# Altium schematic sheet supply_filter.SchDoc
size A4; SheetNumber: 4; SheetTotal: 5
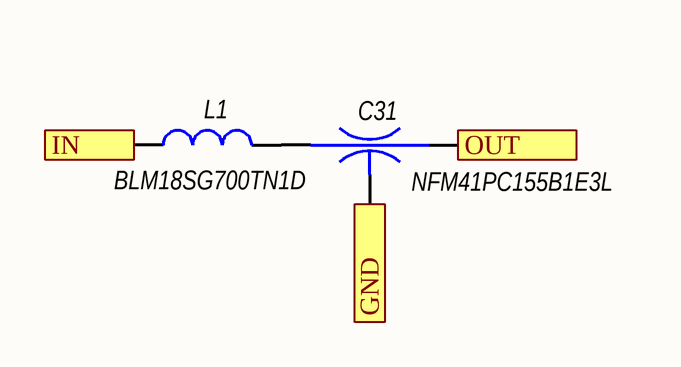
[diagram p0: supply_filter.SchDoc]

## Parts
C31  NFM41PC155B1E3L  [FIL_NFM41PC155B1E3L]
L1  BLM18SG700TN1D  [RES_0603]

## Ports
GND, IN, OUT

## Nets
GND: C31.2 ; port GND
IN: L1.2 ; port IN
OUT: C31.3 ; port OUT
NetC31_1: C31.1 L1.1

## Library data of the parts
C31 = Capacity_filtr: Емкостной фильтр проходной
L1 = FERRITE_BEAD: Дроссель ЭМП; ValueBOM: SDR0403-101k; ValueSCH: 100u; MarkPCB: 101; HelpURL: C:\Datasheets\SRD0403.pdf